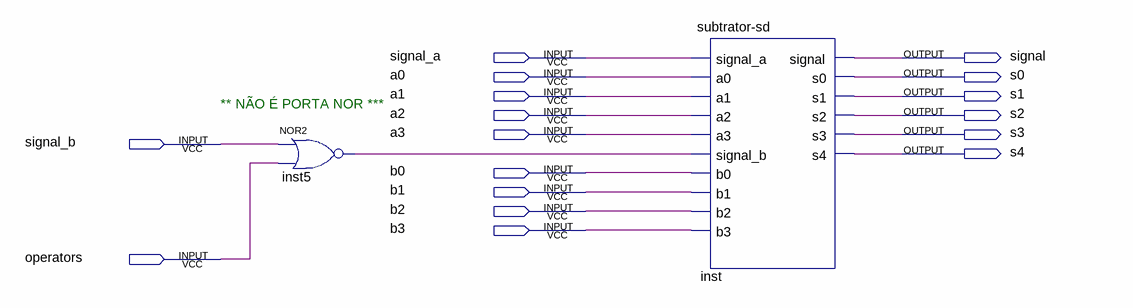
[diagram p0: schematic sheet]
// Quartus schematic sum-or-sub2-nums-4-bit.bdf as structural Verilog: 2 symbols, 17 pins
module \sum-or-sub2-nums-4-bit  (
  input  signal_a,
  input  a0,
  input  a1,
  input  a2,
  input  a3,
  input  signal_b,
  input  b0,
  input  b1,
  input  b2,
  input  b3,
  input  operators,
  output signal,
  output s0,
  output s1,
  output s2,
  output s3,
  output s4
);

  wire inst5_out;

  nor inst5 (inst5_out, signal_b, operators);
  \subtrator-sd  inst (
    .signal_a(signal_a), .a0(a0), .a1(a1), .a2(a2), .a3(a3), .signal_b(inst5_out), .b0(b0), .b1(b1), .b2(b2),
    .b3(b3), .signal(signal), .s0(s0), .s1(s1), .s2(s2), .s3(s3), .s4(s4));

  // Notes on the sheet:
  //   ** NÃO É PORTA NOR ***
endmodule
